# EAGLE design USBPower (EAGLE 9.1.3)
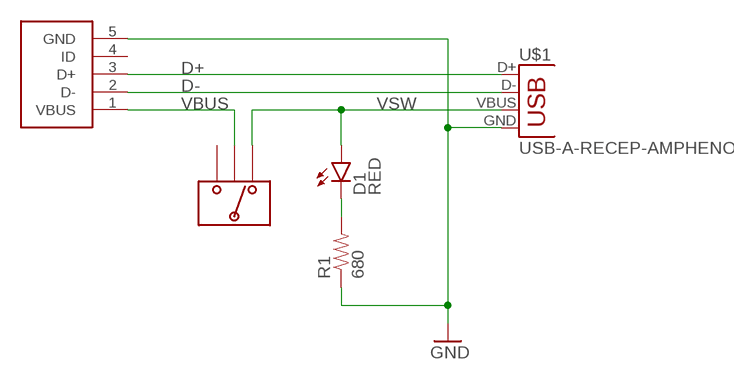
[diagram p0: schematic, sheet 1]

## Parts
D1  RED  LED-RED  [LED-0603]
R1  680  RES-680-0805  [0805]
U$1  USB-A-RECEP-AMPHENOL  [USB-A-RECEP-AMPHENOL]
U$2  USB-MICRO-B-SOCKET-AMPHENOL  [USB-B-SMT-AMPHENOL]
U$3  SWITCH-SLIDE-SPDT-TH  [SWITCH-SLIDE-SPDT-TH]

## Nets
D+: U$1.D+ U$2.3(D+)
D-: U$1.D- U$2.2(D-)
GND: R1.1 U$1.GND U$2.5(GND)
N$6: D1.C R1.2
VBUS: U$2.1(VBUS) U$3.2
VSW: D1.A U$1.VBUS U$3.1
Unconnected: U$2.4(ID) U$3.3

## Library data of the parts
D1 = rickk2:LED-RED: LED RED CLEAR 0603 SMD $0.41 Red 631nm LED Indication - Discrete 2V 0603 (1608 Metric) 5mA@2V https://www.digikey.com/product-detail/en/lite-on-inc/LTST-C193KRKT-5A/160-1830-1-ND/2356251 Res = 270 ohm @ 3.3V Res = 680 ohm 1/8W @ 5V Res = 2.2K 1/8W @ 12V
R1 = rickk2:RES-680-0805: RES SMD 680 OHM 5% 1/8W 0805 $0.10 Panasonic ERJ-6GEYJ681V ±5% 0.125W, 1/8W Chip Resistor 0805 (2012 Metric) Automotive AEC-Q200 Thick Film https://www.digikey.com/product-detail/en/panasonic-electronic-components/ERJ-6GEYJ681V/P680ACT-ND/90033
U$1 = rickk2:USB-A-RECEP-AMPHENOL: USB-A Receptacle https://www.digikey.com/products/en?keywords=609-1045-ND Amphenol 87520-0010BLF
U$2 = rickk2:USB-MICRO-B-SOCKET-AMPHENOL: CONN USB MICRO B RECPT SMT R/A $0.42 Amphenol FCI 10118194-0001LF https://www.digikey.com/products/en?keywords=609-4618-1-nd
U$3 = rickk2:SWITCH-SLIDE-SPDT-TH: SWITCH SLIDE SPDT 200MA 30V $0.58 E-Switch EG1218 https://www.digikey.com/product-detail/en/e-switch/EG1218/EG1903-ND/101726

## Board
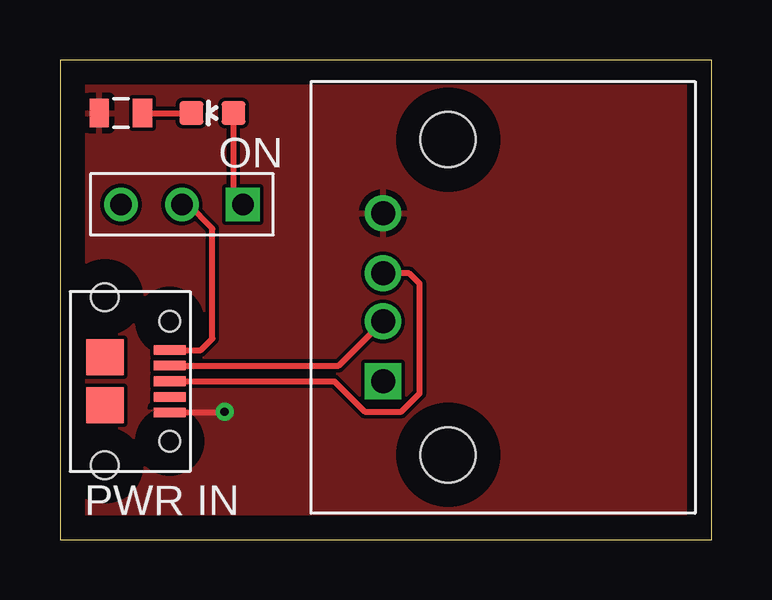
[diagram p1: board, top side]
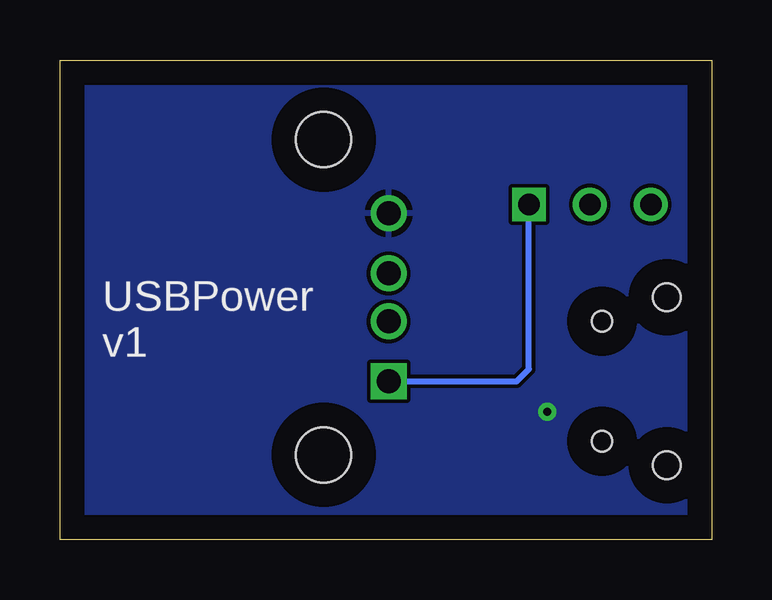
[diagram p2: board, bottom side, seen from below]

Size 27.16 x 19.99 mm. Coordinates in mm from the lower left corner, seen from the top.
Outline: 0,0 27.16,0 27.16,19.99 0,19.99 0,0
Copper layers (1*16): Top 0.035mm / dielectric 1.5mm / Bottom 0.035mm
Design rules "default": minimum track width 6mil, minimum drill 0.35mm, track to track 6mil, track to pad 6mil, pad to pad 6mil, via to via 6mil, smd to smd 6mil, copper to edge 40mil, drill to drill 6mil, minimum pad ring 10mil, minimum via ring 8mil, stop-mask expansion 4mil, vias tented up to drill 0mil, thermal gap 10mil

### Footprints (pad centres in the part's own frame; a part is rotated, then mirrored left to right if it is on the bottom)
LED-0603 = smd 1 x 1: A 0,-0.877; C 0,0.877
0805 = smd 0.8 x 1.2: 1 -0.9,0; 2 0.9,0
USB-A-RECEP-AMPHENOL = drill 1: D+ 4.5,0; D- 2.5,0; GND 7,0 | drill 1 square: VBUS 0,0 | hole 2.3: -3.07,-2.71; 10.07,-2.71
USB-B-SMT-AMPHENOL = smd 0.4 x 1.35: 1 -1.3,0; 2 -0.65,0; 3 0,0; 4 0.65,0; 5 1.3,0 | smd 1.5 x 1.55: P$6 -1,-2.7; P$7 1,-2.7 | hole 0.85: -2.5,0; 2.5,0 | hole 1.15: -3.5,-2.7; 3.5,-2.7
SWITCH-SLIDE-SPDT-TH = drill 0.9 square: 1 -2.54,0 | drill 0.9: 2 0,0; 3 2.54,0

### Placement (x,y rotation side)
D1  6.35,17.78 90 top
R1  2.54,17.78 0 top
U$1  13.46,6.6 90 top
U$2  4.57,6.6 270 top
U$3  5.08,13.97 180 top

### Tracks (layer width: path | path; a pad name or v marks a point on that pad's centre or on a via)
D+
  Top 0.254: U$2.3 11.43,6.6 12.7,5.33 14.22,5.33 14.99,6.1 14.99,10.67 14.55,11.1 U$1.D+
D-
  Top 0.254: U$2.2 11.61,7.25 U$1.D-
GND  (via drill 0.35)
  Top 0.254: U$2.5 6.83,5.3 v6.86,5.33
  pour Top: 0,0 0,20.32 27.94,20.32 27.94,0
  pour Bottom: 0,0 0,20.32 27.94,20.32 27.94,0
N$6
  Top 0.254: R1.2 D1.C
VBUS
  Top 0.254: U$2.1 5.87,7.9 6.35,8.38 6.35,12.95 5.33,13.97 U$3.2
VSW
  Top 0.254: D1.A 7.23,14.36 U$3.1
  Bottom 0.254: U$1.VBUS 8.13,6.6 7.62,7.11 U$3.1

### Text on the board
tPlace: ON | PWR IN
bPlace: USBPower / v1